# EAGLE design smd-led (EAGLE 7.2.0)
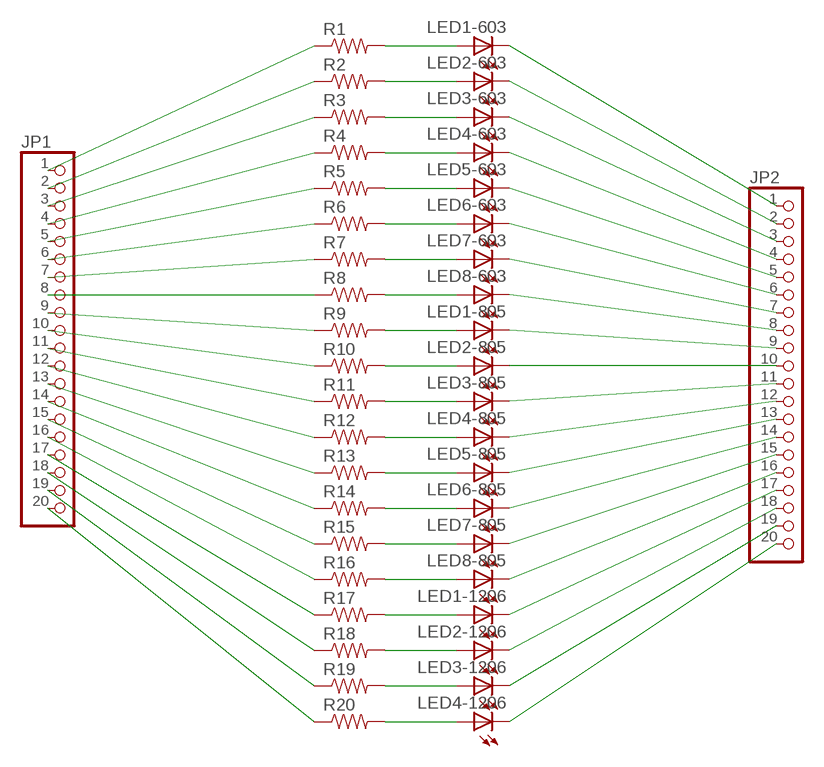
[diagram p0: schematic, sheet 1]

## Parts
JP1  PINHD-1X20  [1X20]
JP2  PINHD-1X20  [1X20]
LED1-603  LEDSML0603  [SML0603]
LED1-805  LEDSML0805  [SML0805]
LED1-1206  LEDSML1206  [SML1206]
LED2-603  LEDSML0603  [SML0603]
LED2-805  LEDSML0805  [SML0805]
LED2-1206  LEDSML1206  [SML1206]
LED3-603  LEDSML0603  [SML0603]
LED3-805  LEDSML0805  [SML0805]
LED3-1206  LEDSML1206  [SML1206]
LED4-603  LEDSML0603  [SML0603]
LED4-805  LEDSML0805  [SML0805]
LED4-1206  LEDSML1206  [SML1206]
LED5-603  LEDSML0603  [SML0603]
LED5-805  LEDSML0805  [SML0805]
LED6-603  LEDSML0603  [SML0603]
LED6-805  LEDSML0805  [SML0805]
LED7-603  LEDSML0603  [SML0603]
LED7-805  LEDSML0805  [SML0805]
LED8-603  LEDSML0603  [SML0603]
LED8-805  LEDSML0805  [SML0805]
R1  RESISTOR0805-RES  [0805]
R2  RESISTOR0805-RES  [0805]
R3  RESISTOR0805-RES  [0805]
R4  RESISTOR0805-RES  [0805]
R5  RESISTOR0805-RES  [0805]
R6  RESISTOR0805-RES  [0805]
R7  RESISTOR0805-RES  [0805]
R8  RESISTOR0805-RES  [0805]
R9  RESISTOR0805-RES  [0805]
R10  RESISTOR0805-RES  [0805]
R11  RESISTOR0805-RES  [0805]
R12  RESISTOR0805-RES  [0805]
R13  RESISTOR0805-RES  [0805]
R14  RESISTOR0805-RES  [0805]
R15  RESISTOR0805-RES  [0805]
R16  RESISTOR0805-RES  [0805]
R17  RESISTOR0805-RES  [0805]
R18  RESISTOR0805-RES  [0805]
R19  RESISTOR0805-RES  [0805]
R20  RESISTOR0805-RES  [0805]

## Nets
N$1: JP1.1 R1.1
N$2: JP1.2 R2.1
N$3: JP1.3 R3.1
N$4: JP1.4 R4.1
N$5: JP1.5 R5.1
N$6: JP1.6 R6.1
N$7: JP1.7 R7.1
N$8: JP1.8 R8.1
N$9: JP1.9 R9.1
N$10: JP1.10 R10.1
N$11: JP1.11 R11.1
N$12: JP1.12 R12.1
N$13: JP1.13 R13.1
N$14: JP1.14 R14.1
N$15: JP1.15 R15.1
N$16: JP1.16 R16.1
N$17: JP1.17 R17.1
N$18: JP1.18 R18.1
N$19: JP1.19 R19.1
N$20: JP1.20 R20.1
N$21: LED1-603.A R1.2
N$22: LED2-603.A R2.2
N$23: LED3-603.A R3.2
N$24: LED4-603.A R4.2
N$25: LED5-603.A R5.2
N$26: LED6-603.A R6.2
N$27: LED7-603.A R7.2
N$28: LED8-603.A R8.2
N$29: LED1-805.A R9.2
N$30: LED2-805.A R10.2
N$31: LED3-805.A R11.2
N$32: LED4-805.A R12.2
N$33: LED5-805.A R13.2
N$34: LED6-805.A R14.2
N$35: LED7-805.A R15.2
N$36: LED8-805.A R16.2
N$37: LED1-1206.A R17.2
N$38: LED2-1206.A R18.2
N$39: LED3-1206.A R19.2
N$40: LED4-1206.A R20.2
N$41: JP2.1 LED1-603.C
N$42: JP2.2 LED2-603.C
N$43: JP2.3 LED3-603.C
N$44: JP2.4 LED4-603.C
N$45: JP2.5 LED5-603.C
N$46: JP2.6 LED6-603.C
N$47: JP2.7 LED7-603.C
N$48: JP2.8 LED8-603.C
N$49: JP2.9 LED1-805.C
N$50: JP2.10 LED2-805.C
N$51: JP2.11 LED3-805.C
N$52: JP2.12 LED4-805.C
N$53: JP2.13 LED5-805.C
N$54: JP2.14 LED6-805.C
N$55: JP2.15 LED7-805.C
N$56: JP2.16 LED8-805.C
N$57: JP2.17 LED1-1206.C
N$58: JP2.18 LED2-1206.C
N$59: JP2.19 LED3-1206.C
N$60: JP2.20 LED4-1206.C

## Library data of the parts
JP1 JP2 = pinhead:PINHD-1X20: PIN HEADER
LED1-603 LED1-805 LED1-1206 LED2-603 LED2-805 LED2-1206 LED3-603 LED3-805 LED3-1206 LED4-603 LED4-805 LED4-1206 LED5-603 LED5-805 LED6-603 LED6-805 LED7-603 LED7-805 LED8-603 LED8-805 = led:LED: LED OSRAM: - CHIPLED LG R971, LG N971, LY N971, LG Q971, LY Q971, LO R971, LY R971 LH N974, LH R974 LS Q976, LO Q976, LY Q976 LO Q996 - Hyper CHIPLED LW Q18S LB Q993, LB Q99A, LB R99A - SideLED LS A670, LO A670, LY A670, LG A670, LP A670 LB A673, LV A673, LT A673, LW A673 LH A674 LY A675 LS A676, LA A676, LO A676, LY A676, LW A676 LS A679, LY A679, LG A679 - Hyper Micro SIDELED® LS Y876, LA Y876, LO Y876, LY Y876 LT Y87S - SmartLED LW L88C, LW L88S LB L89C, LB L89S, LG L890 LS L89K, LO L89K, LY L89K LS L896, LA L896, LO L896, LY L896 - TOPLED LS T670, LO T670, LY T670, LG T670, LP T670 LSG T670, LSP T670, LSY T670, LOP T670, LYG T670 LG T671, LOG T671, LSG T671 LB T673, LV T673, LT T673, LW T673 LH T674 LS T676, LA T676, LO T676, LY T676, LB T676, LH T676, LSB T676, LW T676 LB T67C, LV T67C, LT T67C, LS T67K, LO T67K, LY T67K, LW E67C LS E67B, LA E67B, LO E67B, LY E67B, LB E67C, LV E67C, LT E67C LW T67C LS T679, LY T679, LG T679 LS T770, LO T770, LY T770, LG T770, LP T770 LB T773, LV T773, LT T773, LW T773 LH T774 LS E675, LA E675, LY E675, LS T675 LS T776, LA T776, LO T776, LY T776, LB T776 LHGB T686 LT T68C, LB T68C - Hyper Mini TOPLED® LB M676 - Mini TOPLED Santana® LG M470 LS M47K, LO M47K, LY M47K Source: http://www.osram.convergy.de LUXEON: - LUMILED® LXK2-PW12-R00, LXK2-PW12-S00, LXK2-PW14-U00, LXK2-PW14-V00 LXK2-PM12-R00, LXK2-PM12-S00, LXK2-PM14-U00 LXK2-PE12-Q00, LXK2-PE12-R00, LXK2-PE12-S00, LXK2-PE14-T00, LXK2-PE14-U00 LXK2-PB12-K00, LXK2-PB12-L00, LXK2-PB12-M00, LXK2-PB14-N00, LXK2-PB14-P00, LXK2-PB14-Q00 LXK2-PR12-L00, LXK2-PR12-M00, LXK2-PR14-Q00, LXK2-PR14-R00 LXK2-PD12-Q00, LXK2-PD12-R00, LXK2-PD12-S00 LXK2-PH12-R00, LXK2-PH12-S00 LXK2-PL12-P00, LXK2-PL12-Q00, LXK2-PL12-R00 Source: www.luxeon.com KINGBRIGHT: KA-3528ASYC Source: www.kingbright.com
R1-R20 = SparkFun-Resistors:RESISTOR: Resistor Basic schematic elements and footprints for 0603, 1206, and PTH resistors.

## Board
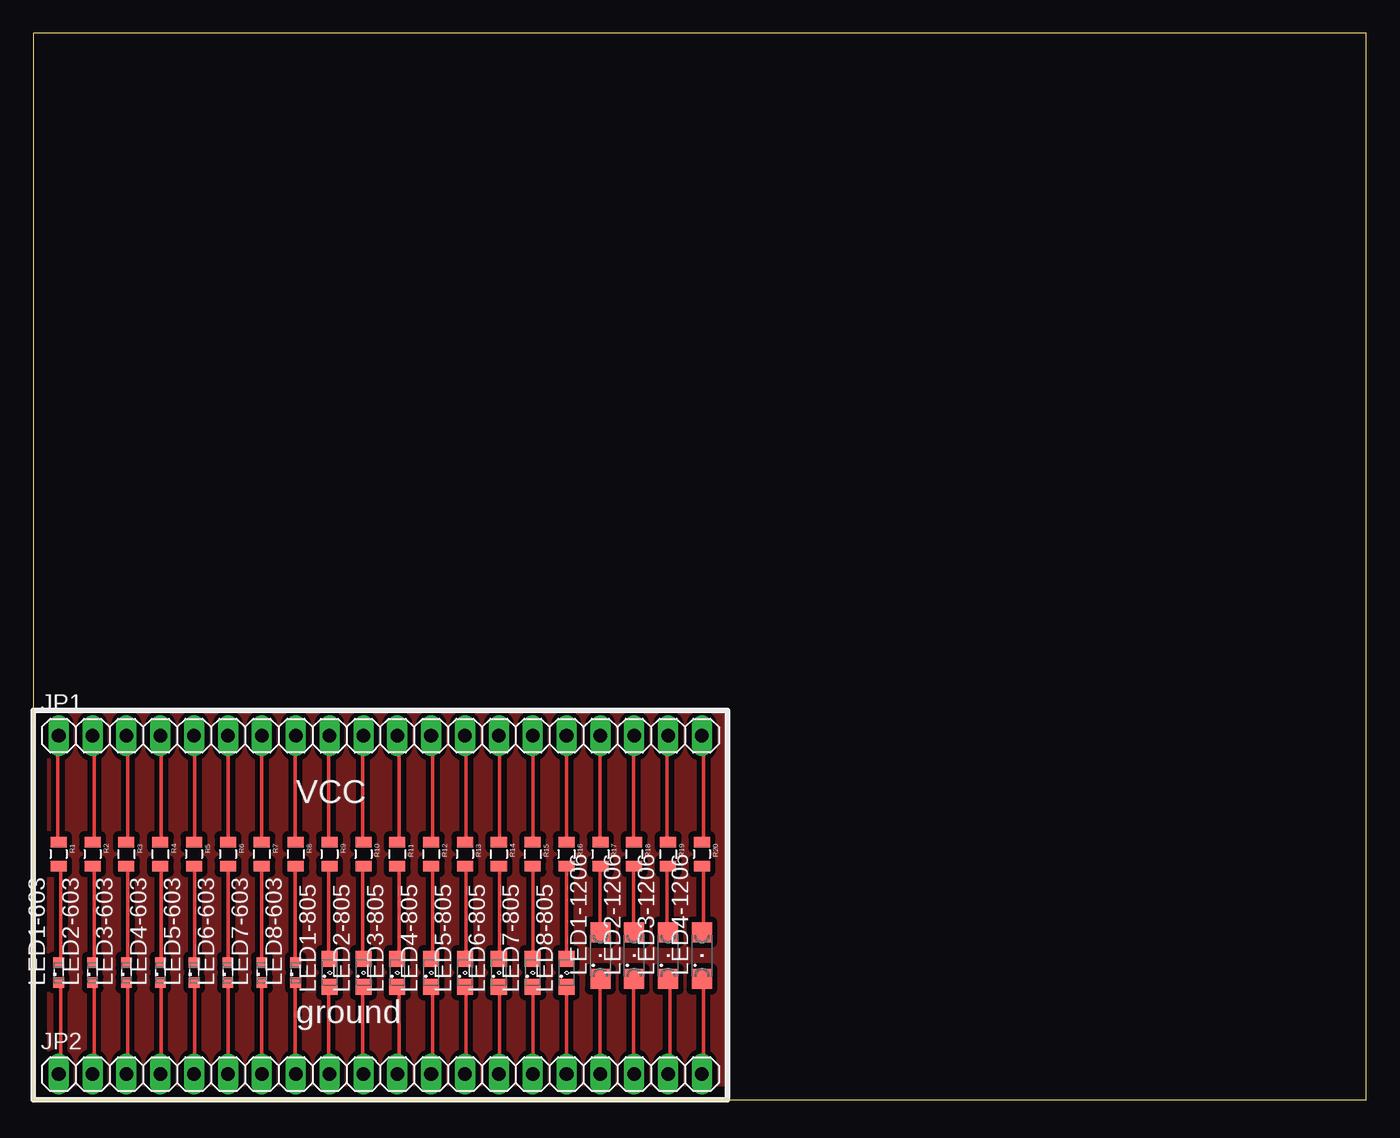
[diagram p1: board, top side]
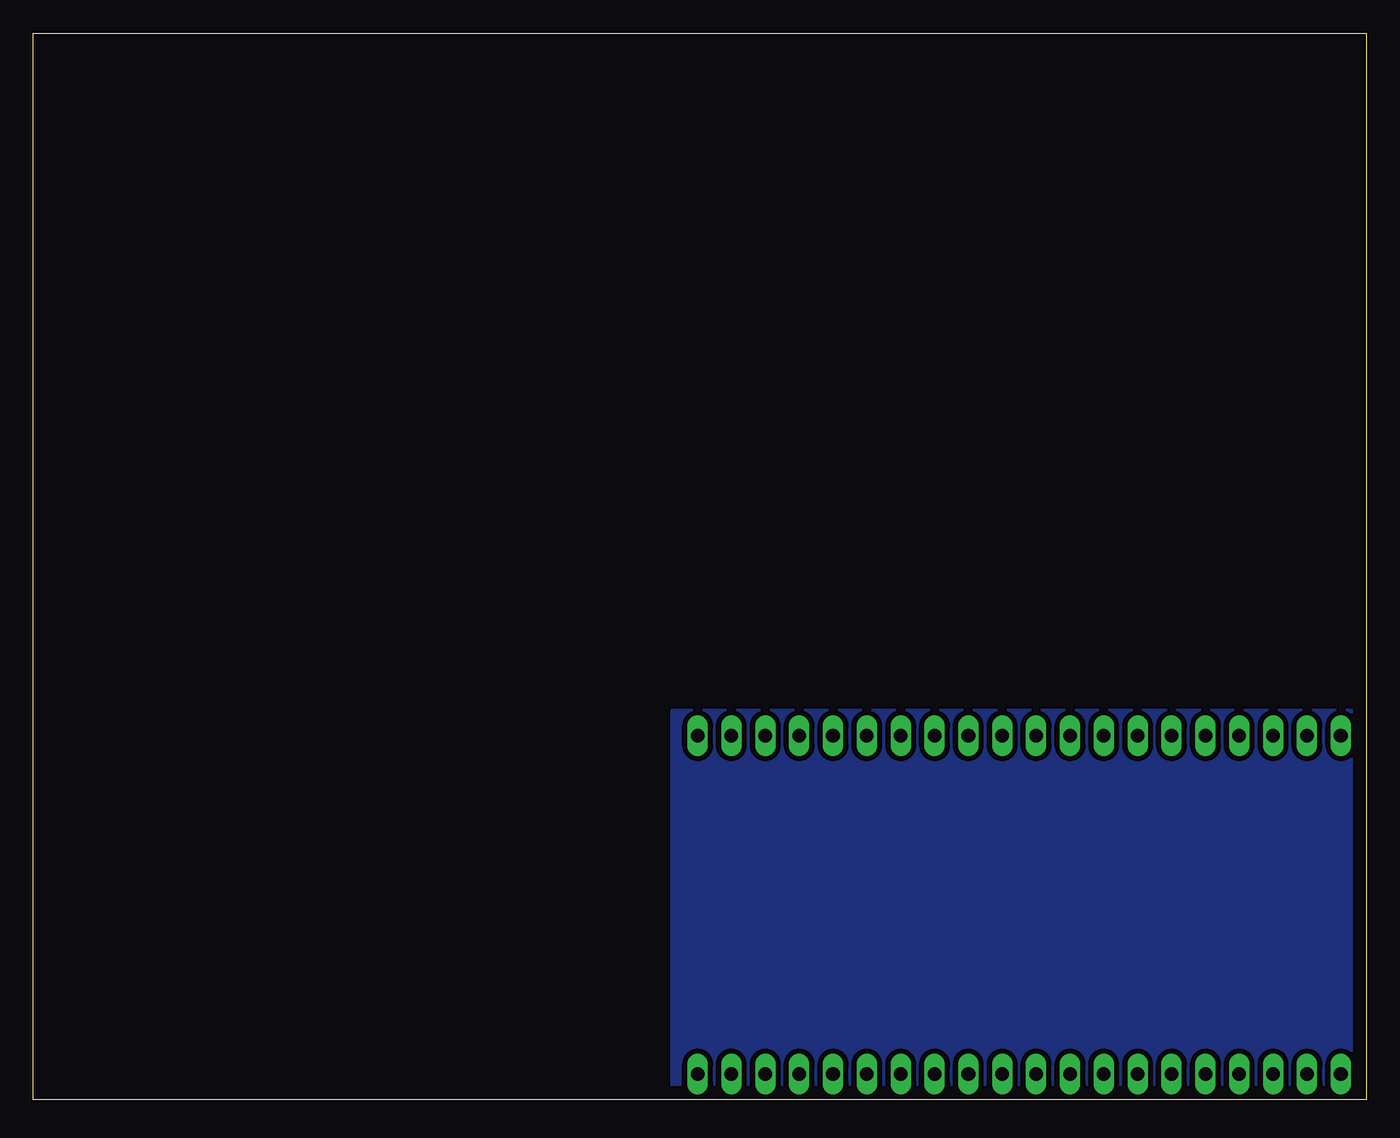
[diagram p2: board, bottom side, seen from below]

Size 100 x 80 mm. Coordinates in mm from the lower left corner, seen from the top.
Outline: 0,0 100,0 100,80 0,80 0,0
Copper layers (1*16): Top 0.035mm / dielectric 1.5mm / Bottom 0.035mm
Design rules "default": minimum track width 10mil, minimum drill 24mil, track to track 8mil, track to pad 8mil, pad to pad 8mil, via to via 8mil, smd to smd 8mil, copper to edge 40mil, drill to drill 8mil, minimum pad ring 10mil, minimum via ring 8mil, stop-mask expansion 4mil, vias tented up to drill 0mil, thermal gap 10mil

### Footprints (pad centres in the part's own frame; a part is rotated, then mirrored left to right if it is on the bottom)
1X20 = drill 1.016 long: 1 -24.13,0; 2 -21.59,0; 3 -19.05,0; 4 -16.51,0; 5 -13.97,0; 6 -11.43,0; 7 -8.89,0; 8 -6.35,0; 9 -3.81,0; 10 -1.27,0; 11 1.27,0; 12 3.81,0; 13 6.35,0; 14 8.89,0; 15 11.43,0; 16 13.97,0; 17 16.51,0; 18 19.05,0; 19 21.59,0; 20 24.13,0
SML0603 = smd 0.8 x 0.8: A 0.75,0; C -0.75,0
SML0805 = smd 1.2 x 1.2: A 1.05,0; C -1.05,0
SML1206 = smd 1.5 x 1.5: A 1.75,0; C -1.75,0
0805 = smd 0.8 x 1.2: 1 -0.9,0; 2 0.9,0

### Placement (x,y rotation side)
JP1  26.04,27.3 0 top
JP2  26.04,1.91 0 top
LED1-603  1.91,9.53 90 top
LED1-805  22.23,9.53 90 top
LED1-1206  42.55,10.79 90 top
LED2-603  4.45,9.53 90 top
LED2-805  24.77,9.53 90 top
LED2-1206  45.09,10.79 90 top
LED3-603  6.99,9.53 90 top
LED3-805  27.3,9.53 90 top
LED3-1206  47.62,10.79 90 top
LED4-603  9.53,9.53 90 top
LED4-805  29.84,9.53 90 top
LED4-1206  50.16,10.79 90 top
LED5-603  12.06,9.53 90 top
LED5-805  32.38,9.53 90 top
LED6-603  14.61,9.53 90 top
LED6-805  34.92,9.53 90 top
LED7-603  17.14,9.53 90 top
LED7-805  37.47,9.53 90 top
LED8-603  19.68,9.53 90 top
LED8-805  40.01,9.53 90 top
R1  1.91,18.41 270 top
R2  4.45,18.41 270 top
R3  6.99,18.41 270 top
R4  9.53,18.41 270 top
R5  12.06,18.41 270 top
R6  14.61,18.41 270 top
R7  17.14,18.41 270 top
R8  19.68,18.41 270 top
R9  22.23,18.41 270 top
R10  24.77,18.41 270 top
R11  27.3,18.41 270 top
R12  29.84,18.41 270 top
R13  32.38,18.41 270 top
R14  34.92,18.41 270 top
R15  37.47,18.41 270 top
R16  40.01,18.41 270 top
R17  42.55,18.41 270 top
R18  45.09,18.41 270 top
R19  47.62,18.41 270 top
R20  50.16,18.41 270 top

### Tracks (layer width: path | path; a pad name or v marks a point on that pad's centre or on a via)
GND
  pour Top (isolate 0.406): 0,29.21 52.07,29.21 52.07,0 0,0
  pour Bottom (isolate 0.406): 0,29.21 52.07,29.21 52.07,0 0,0
N$1
  Top 0.254: R1.1 1.83,19.43 1.83,27.2 JP1.1
N$2
  Top 0.254: R2.1 4.57,19.43 4.57,27.2 JP1.2
N$3
  Top 0.254: R3.1 7.09,19.43 7.09,27.2 JP1.3
N$4
  Top 0.254: R4.1 9.6,19.43 9.6,27.2 JP1.4
N$5
  Top 0.254: R5.1 12.12,19.43 12.12,27.2 JP1.5
N$6
  Top 0.254: R6.1 14.63,19.43 14.63,27.2 JP1.6
N$7
  Top 0.254: JP1.7 R7.1
N$8
  Top 0.254: R8.1 19.66,19.43 19.66,27.2 JP1.8
N$9
  Top 0.254: R9.1 22.17,19.43 22.17,27.2 JP1.9
N$10
  Top 0.254: R10.1 24.69,19.43 24.69,27.2 JP1.10
N$11
  Top 0.254: R11.1 27.43,19.43 27.43,27.2 JP1.11
N$12
  Top 0.254: R12.1 29.95,19.43 29.95,27.2 JP1.12
N$13
  Top 0.254: R13.1 32.46,19.43 32.46,27.2 JP1.13
N$14
  Top 0.254: R14.1 34.98,19.43 34.98,27.2 JP1.14
N$15
  Top 0.254: R15.1 37.49,19.43 37.49,27.2 JP1.15
N$16
  Top 0.254: JP1.16 R16.1
N$17
  Top 0.254: R17.1 42.52,19.43 42.52,27.2 JP1.17
N$18
  Top 0.254: R18.1 45.03,19.43 45.03,27.2 JP1.18
N$19
  Top 0.254: R19.1 47.55,19.43 47.55,27.2 JP1.19
N$20
  Top 0.254: R20.1 50.29,19.43 50.29,27.2 JP1.20
N$21
  Top 0.254: LED1-603.A 2.06,10.29 2.06,17.37 R1.2
N$22
  Top 0.254: LED2-603.A 4.57,10.29 4.57,17.37 R2.2
N$23
  Top 0.254: LED3-603.A 7.09,10.29 7.09,17.37 R3.2
N$24
  Top 0.254: LED4-603.A 9.6,10.29 9.6,17.37 R4.2
N$25
  Top 0.254: LED5-603.A 12.12,10.29 12.12,17.37 R5.2
N$26
  Top 0.254: LED6-603.A 14.63,10.29 14.63,17.37 R6.2
N$27
  Top 0.254: R7.2 LED7-603.A
N$28
  Top 0.254: LED8-603.A 19.66,10.29 19.66,17.37 R8.2
N$29
  Top 0.254: LED1-805.A 22.17,10.74 22.17,17.37 R9.2
N$30
  Top 0.254: LED2-805.A 24.69,10.74 24.69,17.37 R10.2
N$31
  Top 0.254: LED3-805.A 27.43,10.74 27.43,17.37 R11.2
N$32
  Top 0.254: LED4-805.A 29.95,10.74 29.95,17.37 R12.2
N$33
  Top 0.254: LED5-805.A 32.46,10.74 32.46,17.37 R13.2
N$34
  Top 0.254: LED6-805.A 34.98,10.74 34.98,17.37 R14.2
N$35
  Top 0.254: LED7-805.A 37.49,10.74 37.49,17.37 R15.2
N$36
  Top 0.254: R16.2 LED8-805.A
N$37
  Top 0.254: R17.2 42.52,17.37 42.52,12.57 LED1-1206.A
N$38
  Top 0.254: R18.2 45.03,17.37 45.03,12.57 LED2-1206.A
N$39
  Top 0.254: R19.2 47.55,17.37 47.55,12.57 LED3-1206.A
N$40
  Top 0.254: R20.2 50.29,17.37 50.29,12.57 LED4-1206.A
N$41
  Top 0.254: LED1-603.C 2.06,8.69 2.06,2.06 JP2.1
N$42
  Top 0.254: LED2-603.C 4.57,8.69 4.57,2.06 JP2.2
N$43
  Top 0.254: LED3-603.C 7.09,8.69 7.09,2.06 JP2.3
N$44
  Top 0.254: LED4-603.C 9.6,8.69 9.6,2.06 JP2.4
N$45
  Top 0.254: LED5-603.C 12.12,8.69 12.12,2.06 JP2.5
N$46
  Top 0.254: LED6-603.C 14.63,8.69 14.63,2.06 JP2.6
N$47
  Top 0.254: JP2.7 LED7-603.C
N$48
  Top 0.254: LED8-603.C 19.66,8.69 19.66,2.06 JP2.8
N$49
  Top 0.254: LED1-805.C 22.17,8.46 22.17,2.06 JP2.9
N$50
  Top 0.254: LED2-805.C 24.69,8.46 24.69,2.06 JP2.10
N$51
  Top 0.254: LED3-805.C 27.43,8.46 27.43,2.06 JP2.11
N$52
  Top 0.254: LED4-805.C 29.95,8.46 29.95,2.06 JP2.12
N$53
  Top 0.254: LED5-805.C 32.46,8.46 32.46,2.06 JP2.13
N$54
  Top 0.254: LED6-805.C 34.98,8.46 34.98,2.06 JP2.14
N$55
  Top 0.254: LED7-805.C 37.49,8.46 37.49,2.06 JP2.15
N$56
  Top 0.254: JP2.16 LED8-805.C
N$57
  Top 0.254: LED1-1206.C 42.52,8.91 42.52,2.06 JP2.17
N$58
  Top 0.254: LED2-1206.C 45.03,8.91 45.03,2.06 JP2.18
N$59
  Top 0.254: LED3-1206.C 47.78,8.91 47.78,2.06 JP2.19
N$60
  Top 0.254: LED4-1206.C 50.29,8.91 50.29,2.06 JP2.20

### Text on the board
_tsilk: VCC | ground